# Altium schematic sheet FrameWork.SchDoc
size A4
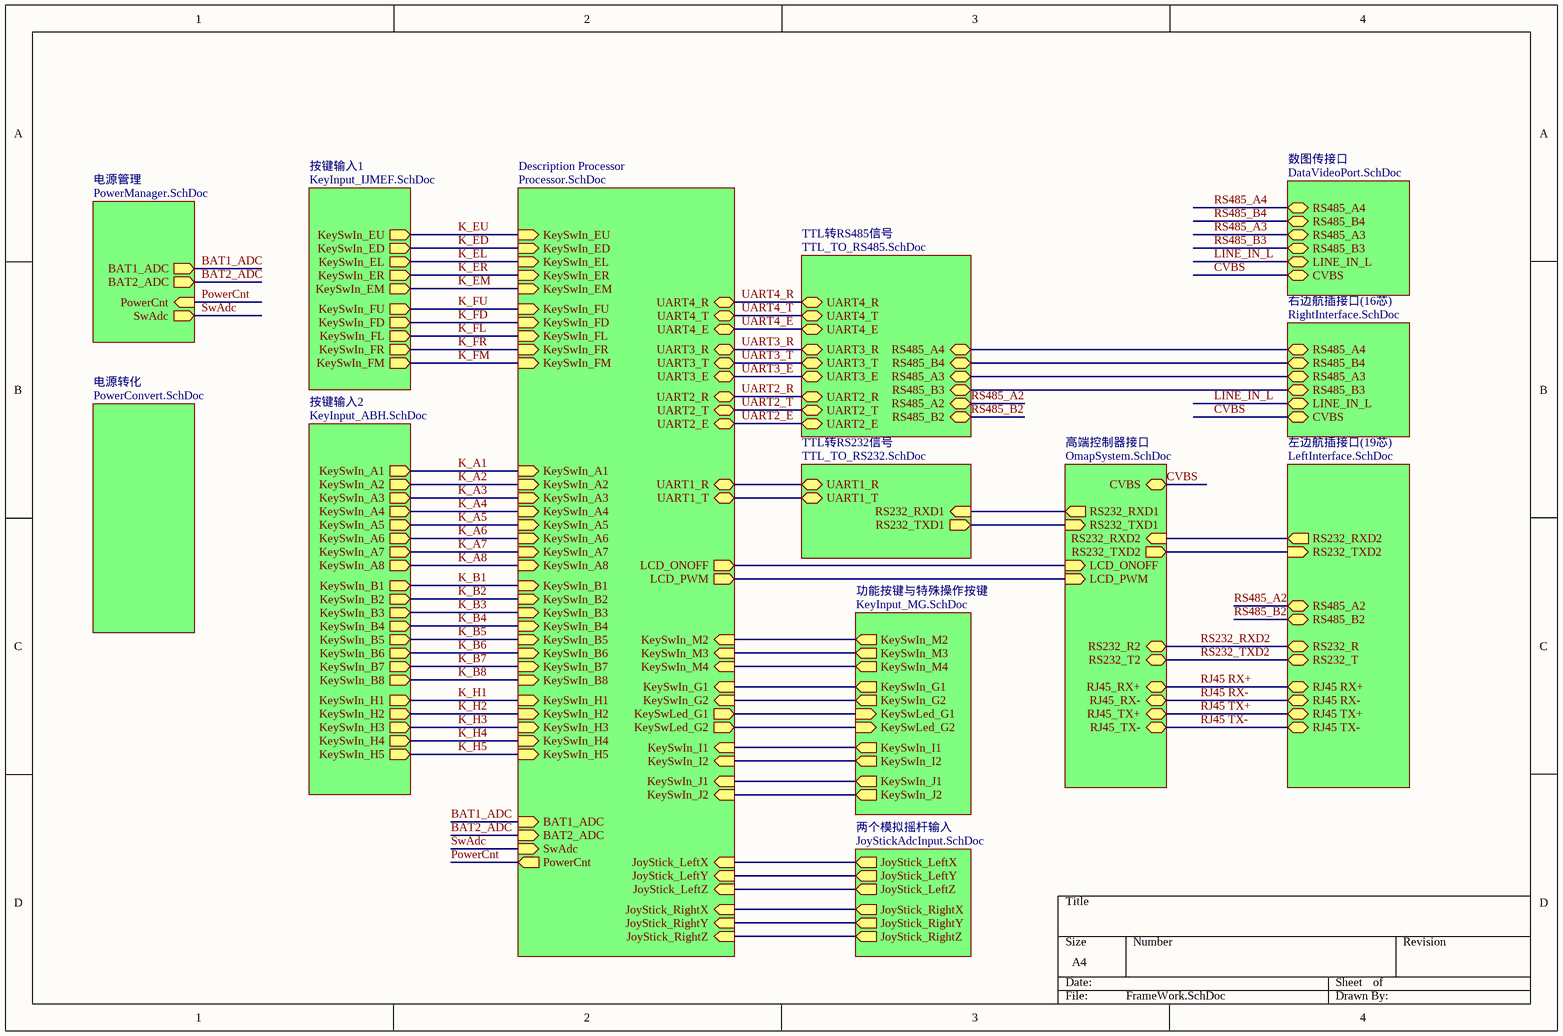
[diagram p0: FrameWork.SchDoc]

## Sub-sheets
Description Processor = Processor.SchDoc: KeySwIn_EU (in), KeySwIn_ED (in), KeySwIn_EL (in), KeySwIn_ER (in), KeySwIn_EM (in), KeySwIn_FU (in), KeySwIn_FD (in), KeySwIn_FL (in), KeySwIn_FR (in), KeySwIn_FM (in), KeySwIn_A2 (in), KeySwIn_A3 (in), KeySwIn_A4 (in), KeySwIn_A5 (in), KeySwIn_A6 (in), KeySwIn_A7 (in), KeySwIn_A8 (in), KeySwIn_A1 (in), KeySwIn_B2 (in), KeySwIn_B3 (in), KeySwIn_B4 (in), KeySwIn_B5 (in), KeySwIn_B6 (in), KeySwIn_B7 (in), KeySwIn_B8 (in), KeySwIn_B1 (in), KeySwIn_H2 (in), KeySwIn_H3 (in), KeySwIn_H4 (in), KeySwIn_H5 (in), KeySwIn_H1 (in), JoyStick_LeftX (in), JoyStick_LeftY (in), JoyStick_LeftZ (in), JoyStick_RightX (in), JoyStick_RightY (in), JoyStick_RightZ (in), UART1_T (bidir), UART1_R (bidir), UART3_T (bidir), UART3_R (bidir), UART3_E (bidir), UART2_T (bidir), UART2_R (bidir), UART4_T (bidir), UART4_R (bidir), UART4_E (bidir), UART2_E (bidir), BAT2_ADC (in), BAT1_ADC (in), KeySwIn_M3 (in), KeySwIn_M4 (in), KeySwIn_M2 (in), KeySwIn_G1 (in), KeySwIn_G2 (in), KeySwLed_G1 (out), KeySwLed_G2 (out), KeySwIn_I1 (in), KeySwIn_I2 (in), KeySwIn_J1 (in), KeySwIn_J2 (in), SwAdc (in), PowerCnt (out), LCD_ONOFF (out), LCD_PWM (out)
TTL转RS232信号 = TTL_TO_RS232.SchDoc: RS232_RXD1 (in), UART1_T (bidir), UART1_R (bidir), RS232_TXD1 (out)
TTL转RS485信号 = TTL_TO_RS485.SchDoc: UART3_T (bidir), UART3_R (bidir), RS485_B3 (bidir), RS485_A3 (bidir), RS485_B4 (bidir), RS485_A4 (bidir), UART3_E (bidir), UART2_T (bidir), UART2_R (bidir), UART4_T (bidir), UART4_R (bidir), UART4_E (bidir), UART2_E (bidir), RS485_B2 (bidir), RS485_A2 (bidir)
两个模拟摇杆输入 = JoyStickAdcInput.SchDoc: JoyStick_LeftX (out), JoyStick_LeftY (out), JoyStick_LeftZ (out), JoyStick_RightX (out), JoyStick_RightY (out), JoyStick_RightZ (out)
功能按键与特殊操作按键 = KeyInput_MG.SchDoc: KeySwIn_M2 (out), KeySwIn_M3 (out), KeySwIn_M4 (out), KeySwIn_G2 (out), KeySwLed_G1 (in), KeySwIn_G1 (out), KeySwLed_G2 (in), KeySwIn_I1 (out), KeySwIn_I2 (out), KeySwIn_J1 (out), KeySwIn_J2 (out)
右边航插接口(16芯) = RightInterface.SchDoc: RS485_B4 (bidir), RS485_A4 (bidir), RS485_B3 (bidir), RS485_A3 (bidir), CVBS (bidir), LINE_IN_L (bidir)
左边航插接口(19芯) = LeftInterface.SchDoc: RS232_T (bidir), RS232_R (bidir), RS485_B2 (bidir), RS485_A2 (bidir), RJ45 RX+ (bidir), RJ45 TX+ (bidir), RJ45 RX- (bidir), RJ45 TX- (bidir), RS232_RXD2 (out), RS232_TXD2 (in)
按键输入1 = KeyInput_IJMEF.SchDoc: KeySwIn_EU (out), KeySwIn_ED (out), KeySwIn_EL (out), KeySwIn_ER (out), KeySwIn_EM (out), KeySwIn_FU (out), KeySwIn_FD (out), KeySwIn_FL (out), KeySwIn_FR (out), KeySwIn_FM (out)
按键输入2 = KeyInput_ABH.SchDoc: KeySwIn_A1 (out), KeySwIn_A2 (out), KeySwIn_A3 (out), KeySwIn_A4 (out), KeySwIn_A5 (out), KeySwIn_A6 (out), KeySwIn_A7 (out), KeySwIn_A8 (out), KeySwIn_B1 (out), KeySwIn_B2 (out), KeySwIn_B3 (out), KeySwIn_B4 (out), KeySwIn_B5 (out), KeySwIn_B6 (out), KeySwIn_B7 (out), KeySwIn_B8 (out), KeySwIn_H1 (out), KeySwIn_H2 (out), KeySwIn_H3 (out), KeySwIn_H4 (out), KeySwIn_H5 (out)
数图传接口 = DataVideoPort.SchDoc: RS485_B4 (bidir), RS485_A4 (bidir), RS485_B3 (bidir), RS485_A3 (bidir), CVBS (bidir), LINE_IN_L (bidir)
电源管理 = PowerManager.SchDoc: BAT2_ADC (out), BAT1_ADC (out), PowerCnt (in), SwAdc (out)
电源转化 = PowerConvert.SchDoc: no entries
高端控制器接口 = OmapSystem.SchDoc: RJ45_RX+ (bidir), RJ45_TX+ (bidir), RJ45_RX- (bidir), RJ45_TX- (bidir), RS232_T2 (bidir), RS232_R2 (bidir), RS232_RXD1 (out), RS232_TXD1 (in), CVBS (bidir), LCD_ONOFF (in), LCD_PWM (in), RS232_RXD2 (in), RS232_TXD2 (out)

## Nets
BAT1_ADC: sheet Description Processor/BAT1_ADC, sheet 电源管理/BAT1_ADC
BAT2_ADC: sheet Description Processor/BAT2_ADC, sheet 电源管理/BAT2_ADC
CVBS: sheet 高端控制器接口/CVBS, sheet 右边航插接口(16芯)/CVBS, sheet 数图传接口/CVBS
K_A1: sheet Description Processor/KeySwIn_A1, sheet 按键输入2/KeySwIn_A1
K_A2: sheet Description Processor/KeySwIn_A2, sheet 按键输入2/KeySwIn_A2
K_A3: sheet Description Processor/KeySwIn_A3, sheet 按键输入2/KeySwIn_A3
K_A4: sheet Description Processor/KeySwIn_A4, sheet 按键输入2/KeySwIn_A4
K_A5: sheet Description Processor/KeySwIn_A5, sheet 按键输入2/KeySwIn_A5
K_A6: sheet Description Processor/KeySwIn_A6, sheet 按键输入2/KeySwIn_A6
K_A7: sheet Description Processor/KeySwIn_A7, sheet 按键输入2/KeySwIn_A7
K_A8: sheet Description Processor/KeySwIn_A8, sheet 按键输入2/KeySwIn_A8
K_B1: sheet Description Processor/KeySwIn_B1, sheet 按键输入2/KeySwIn_B1
K_B2: sheet Description Processor/KeySwIn_B2, sheet 按键输入2/KeySwIn_B2
K_B3: sheet Description Processor/KeySwIn_B3, sheet 按键输入2/KeySwIn_B3
K_B4: sheet Description Processor/KeySwIn_B4, sheet 按键输入2/KeySwIn_B4
K_B5: sheet Description Processor/KeySwIn_B5, sheet 按键输入2/KeySwIn_B5
K_B6: sheet Description Processor/KeySwIn_B6, sheet 按键输入2/KeySwIn_B6
K_B7: sheet Description Processor/KeySwIn_B7, sheet 按键输入2/KeySwIn_B7
K_B8: sheet Description Processor/KeySwIn_B8, sheet 按键输入2/KeySwIn_B8
K_ED: sheet Description Processor/KeySwIn_ED, sheet 按键输入1/KeySwIn_ED
K_EL: sheet Description Processor/KeySwIn_EL, sheet 按键输入1/KeySwIn_EL
K_EM: sheet Description Processor/KeySwIn_EM, sheet 按键输入1/KeySwIn_EM
K_ER: sheet Description Processor/KeySwIn_ER, sheet 按键输入1/KeySwIn_ER
K_EU: sheet Description Processor/KeySwIn_EU, sheet 按键输入1/KeySwIn_EU
K_FD: sheet Description Processor/KeySwIn_FD, sheet 按键输入1/KeySwIn_FD
K_FL: sheet Description Processor/KeySwIn_FL, sheet 按键输入1/KeySwIn_FL
K_FM: sheet Description Processor/KeySwIn_FM, sheet 按键输入1/KeySwIn_FM
K_FR: sheet Description Processor/KeySwIn_FR, sheet 按键输入1/KeySwIn_FR
K_FU: sheet Description Processor/KeySwIn_FU, sheet 按键输入1/KeySwIn_FU
K_H1: sheet Description Processor/KeySwIn_H1, sheet 按键输入2/KeySwIn_H1
K_H2: sheet Description Processor/KeySwIn_H2, sheet 按键输入2/KeySwIn_H2
K_H3: sheet Description Processor/KeySwIn_H3, sheet 按键输入2/KeySwIn_H3
K_H4: sheet Description Processor/KeySwIn_H4, sheet 按键输入2/KeySwIn_H4
K_H5: sheet Description Processor/KeySwIn_H5, sheet 按键输入2/KeySwIn_H5
LINE_IN_L: sheet 右边航插接口(16芯)/LINE_IN_L, sheet 数图传接口/LINE_IN_L
PowerCnt: sheet Description Processor/PowerCnt, sheet 电源管理/PowerCnt
RJ45 RX+: sheet 高端控制器接口/RJ45_RX+, sheet 左边航插接口(19芯)/RJ45 RX+
RJ45 RX-: sheet 高端控制器接口/RJ45_RX-, sheet 左边航插接口(19芯)/RJ45 RX-
RJ45 TX+: sheet 高端控制器接口/RJ45_TX+, sheet 左边航插接口(19芯)/RJ45 TX+
RJ45 TX-: sheet 高端控制器接口/RJ45_TX-, sheet 左边航插接口(19芯)/RJ45 TX-
RS232_RXD2: sheet 高端控制器接口/RS232_R2, sheet 左边航插接口(19芯)/RS232_R
RS232_TXD2: sheet 高端控制器接口/RS232_T2, sheet 左边航插接口(19芯)/RS232_T
RS485_A2: sheet 左边航插接口(19芯)/RS485_A2, sheet TTL转RS485信号/RS485_A2
RS485_A3: sheet 数图传接口/RS485_A3
RS485_A4: sheet 数图传接口/RS485_A4
RS485_B2: sheet 左边航插接口(19芯)/RS485_B2, sheet TTL转RS485信号/RS485_B2
RS485_B3: sheet 数图传接口/RS485_B3
RS485_B4: sheet 数图传接口/RS485_B4
SwAdc: sheet Description Processor/SwAdc, sheet 电源管理/SwAdc
UART2_E: sheet Description Processor/UART2_E, sheet TTL转RS485信号/UART2_E
UART2_R: sheet Description Processor/UART2_R, sheet TTL转RS485信号/UART2_R
UART2_T: sheet Description Processor/UART2_T, sheet TTL转RS485信号/UART2_T
UART3_E: sheet Description Processor/UART3_E, sheet TTL转RS485信号/UART3_E
UART3_R: sheet Description Processor/UART3_R, sheet TTL转RS485信号/UART3_R
UART3_T: sheet Description Processor/UART3_T, sheet TTL转RS485信号/UART3_T
UART4_E: sheet Description Processor/UART4_E, sheet TTL转RS485信号/UART4_E
UART4_R: sheet Description Processor/UART4_R, sheet TTL转RS485信号/UART4_R
UART4_T: sheet Description Processor/UART4_T, sheet TTL转RS485信号/UART4_T
(unnamed): sheet Description Processor/JoyStick_LeftX, sheet 两个模拟摇杆输入/JoyStick_LeftX
(unnamed): sheet Description Processor/JoyStick_LeftY, sheet 两个模拟摇杆输入/JoyStick_LeftY
(unnamed): sheet Description Processor/JoyStick_LeftZ, sheet 两个模拟摇杆输入/JoyStick_LeftZ
(unnamed): sheet Description Processor/JoyStick_RightX, sheet 两个模拟摇杆输入/JoyStick_RightX
(unnamed): sheet Description Processor/JoyStick_RightY, sheet 两个模拟摇杆输入/JoyStick_RightY
(unnamed): sheet Description Processor/JoyStick_RightZ, sheet 两个模拟摇杆输入/JoyStick_RightZ
(unnamed): sheet Description Processor/UART1_T, sheet TTL转RS232信号/UART1_T
(unnamed): sheet Description Processor/UART1_R, sheet TTL转RS232信号/UART1_R
(unnamed): sheet Description Processor/KeySwIn_M3, sheet 功能按键与特殊操作按键/KeySwIn_M3
(unnamed): sheet Description Processor/KeySwIn_M4, sheet 功能按键与特殊操作按键/KeySwIn_M4
(unnamed): sheet Description Processor/KeySwIn_M2, sheet 功能按键与特殊操作按键/KeySwIn_M2
(unnamed): sheet Description Processor/KeySwIn_G1, sheet 功能按键与特殊操作按键/KeySwIn_G1
(unnamed): sheet Description Processor/KeySwIn_G2, sheet 功能按键与特殊操作按键/KeySwIn_G2
(unnamed): sheet Description Processor/KeySwLed_G1, sheet 功能按键与特殊操作按键/KeySwLed_G1
(unnamed): sheet Description Processor/KeySwLed_G2, sheet 功能按键与特殊操作按键/KeySwLed_G2
(unnamed): sheet Description Processor/KeySwIn_I1, sheet 功能按键与特殊操作按键/KeySwIn_I1
(unnamed): sheet Description Processor/KeySwIn_I2, sheet 功能按键与特殊操作按键/KeySwIn_I2
(unnamed): sheet Description Processor/KeySwIn_J1, sheet 功能按键与特殊操作按键/KeySwIn_J1
(unnamed): sheet Description Processor/KeySwIn_J2, sheet 功能按键与特殊操作按键/KeySwIn_J2
(unnamed): sheet Description Processor/LCD_ONOFF, sheet 高端控制器接口/LCD_ONOFF
(unnamed): sheet Description Processor/LCD_PWM, sheet 高端控制器接口/LCD_PWM
(unnamed): sheet 高端控制器接口/RS232_RXD1, sheet TTL转RS232信号/RS232_RXD1
(unnamed): sheet 高端控制器接口/RS232_TXD1, sheet TTL转RS232信号/RS232_TXD1
(unnamed): sheet 高端控制器接口/RS232_RXD2, sheet 左边航插接口(19芯)/RS232_RXD2
(unnamed): sheet 高端控制器接口/RS232_TXD2, sheet 左边航插接口(19芯)/RS232_TXD2
(unnamed): sheet 右边航插接口(16芯)/RS485_B4, sheet TTL转RS485信号/RS485_B4
(unnamed): sheet 右边航插接口(16芯)/RS485_A4, sheet TTL转RS485信号/RS485_A4
(unnamed): sheet 右边航插接口(16芯)/RS485_B3, sheet TTL转RS485信号/RS485_B3
(unnamed): sheet 右边航插接口(16芯)/RS485_A3, sheet TTL转RS485信号/RS485_A3